# Altium schematic sheet LED Circuit.SchDoc
size A4
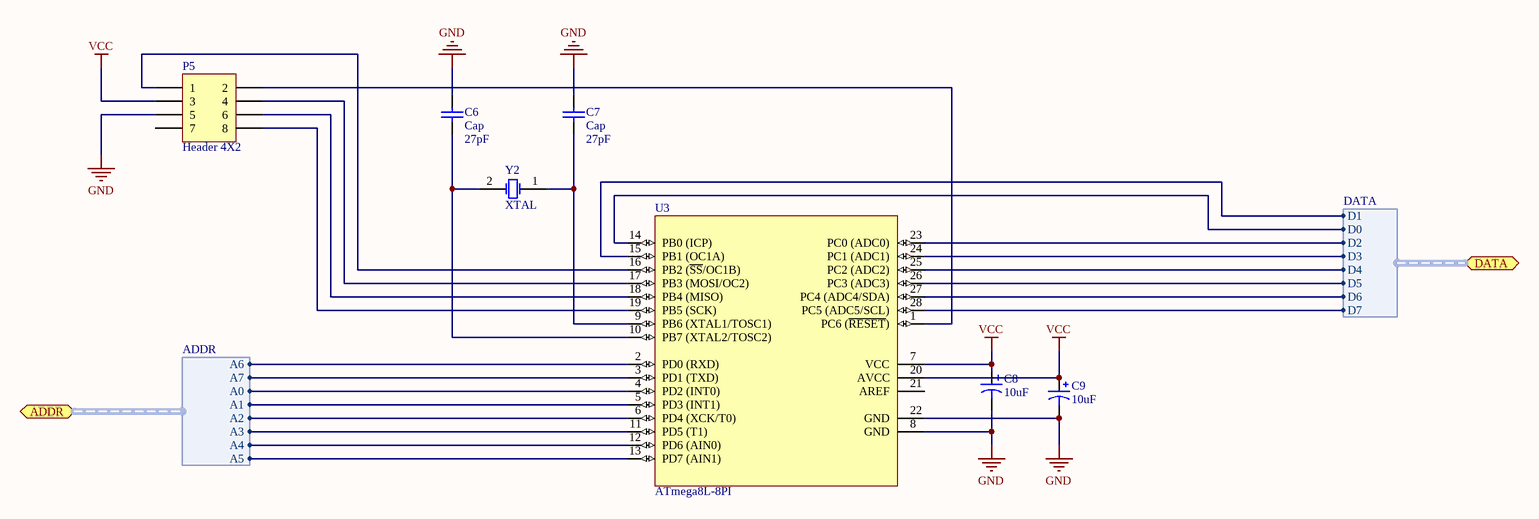
[diagram p0: LED Circuit.SchDoc]

## Parts
C6  Cap  value 27pF  [CAPR2.54-5.1x3.2]
C7  Cap  value 27pF  [CAPR2.54-5.1x3.2]
C8  value 10uF  [CAPPR1.5-4x5]  (hidden comment: Cap Pol1)
C9  value 10uF  [CAPPR1.5-4x5]  (hidden comment: Cap Pol1)
P5  Header 4X2  [HDR2X4]
U3  ATmega8L-8PI  [28P3]
Y2  XTAL  [Crystal Oscillator]

## Ports
ADDR (harness ADDR), DATA (harness DATA)

## Harnesses
ADDR: A6, A7, A0, A1, A2, A3, A4, A5
DATA: D1, D0, D2, D3, D4, D5, D6, D7

## Nets
GND: C6.2 C7.2 C8.2 C9.2 P5.5 U3.8(GND) U3.22(GND)
VCC: C8.1 C9.1 P5.3 U3.7(VCC) U3.20(AVCC)
NetC6_1: C6.1 U3.10(PB7_(XTAL2/TOSC2)) Y2.2(OSC2)
NetC7_1: C7.1 U3.9(PB6_(XTAL1/TOSC1)) Y2.1(OSC1)
NetP5_1: P5.1 U3.16(PB2_(~{SS}/OC1B))
NetP5_2: P5.2 U3.1(PC6_(~{RESET}))
NetP5_4: P5.4 U3.17(PB3_(MOSI/OC2))
NetP5_6: P5.6 U3.18(PB4_(MISO))
NetP5_8: P5.8 U3.19(PB5_(SCK))
NetU3_2: U3.2(PD0_(RXD)) ; port ADDR.A6
NetU3_3: U3.3(PD1_(TXD)) ; port ADDR.A7
NetU3_4: U3.4(PD2_(INT0)) ; port ADDR.A0
NetU3_5: U3.5(PD3_(INT1)) ; port ADDR.A1
NetU3_6: U3.6(PD4_(XCK/T0)) ; port ADDR.A2
NetU3_11: U3.11(PD5_(T1)) ; port ADDR.A3
NetU3_12: U3.12(PD6_(AIN0)) ; port ADDR.A4
NetU3_13: U3.13(PD7_(AIN1)) ; port ADDR.A5
NetU3_14: U3.14(PB0_(ICP)) ; port DATA.D0
NetU3_15: U3.15(PB1_(OC1A)) ; port DATA.D1
NetU3_23: U3.23(PC0_(ADC0)) ; port DATA.D2
NetU3_24: U3.24(PC1_(ADC1)) ; port DATA.D3
NetU3_25: U3.25(PC2_(ADC2)) ; port DATA.D4
NetU3_26: U3.26(PC3_(ADC3)) ; port DATA.D5
NetU3_27: U3.27(PC4_(ADC4/SDA)) ; port DATA.D6
NetU3_28: U3.28(PC5_(ADC5/SCL)) ; port DATA.D7

Not connected (* = marked no-connect by the designer): P5 7; U3 21(AREF)

## Library data of the parts
C6 C7 = Cap: Capacitor; Published: 8-Jun-2000; LatestRevisionDate: 17-Jul-2002; LatestRevisionNote: Re-released for DXP Platform.; PackageReference: RAD-0.3; Publisher: Altium Limited
C8 C9 = Cap Pol1: Polarized Capacitor (Radial); Published: 8-Jun-2000; LatestRevisionDate: 17-Jul-2002; LatestRevisionNote: Re-released for DXP Platform.; PackageReference: RB7.6-15; Publisher: Altium Limited
P5 = Header 4X2: Header, 4-Pin, Dual row; LatestRevisionDate: 17-Jul-2002; LatestRevisionNote: Re-released for DXP Platform.; Publisher: Altium Limited
U3 = ATmega8L-8PI: 8-Bit AVR Microcontroller with 8K Bytes of In-System Programmable Flash Memory; Published: 17-Sep-2003; LatestRevisionDate: 04-Mar-2005; LatestRevisionNote: Stylized 3D Model Added.; DatasheetVersion: 2486H-AVR-09/02; PackageVersion: revB, Sep-2001; PackageReference: 28P3; Publisher: Altium Limited; PackageDescription: DIP; 28 Leads; Row Spacing 7.62 mm; Pitch 2.54 mm; ComponentLink1Description: Manufacturer Link; ComponentLink1URL: http://www.atmel.com; ComponentLink2Description: Datasheet; ComponentLink2URL: http://www.atmel.com/dyn/resources/prod_documents/doc2486.pdf
Y2 = Crystal Oscillator